# EAGLE design ControlPCB_v5 (EAGLE 9.7.0)
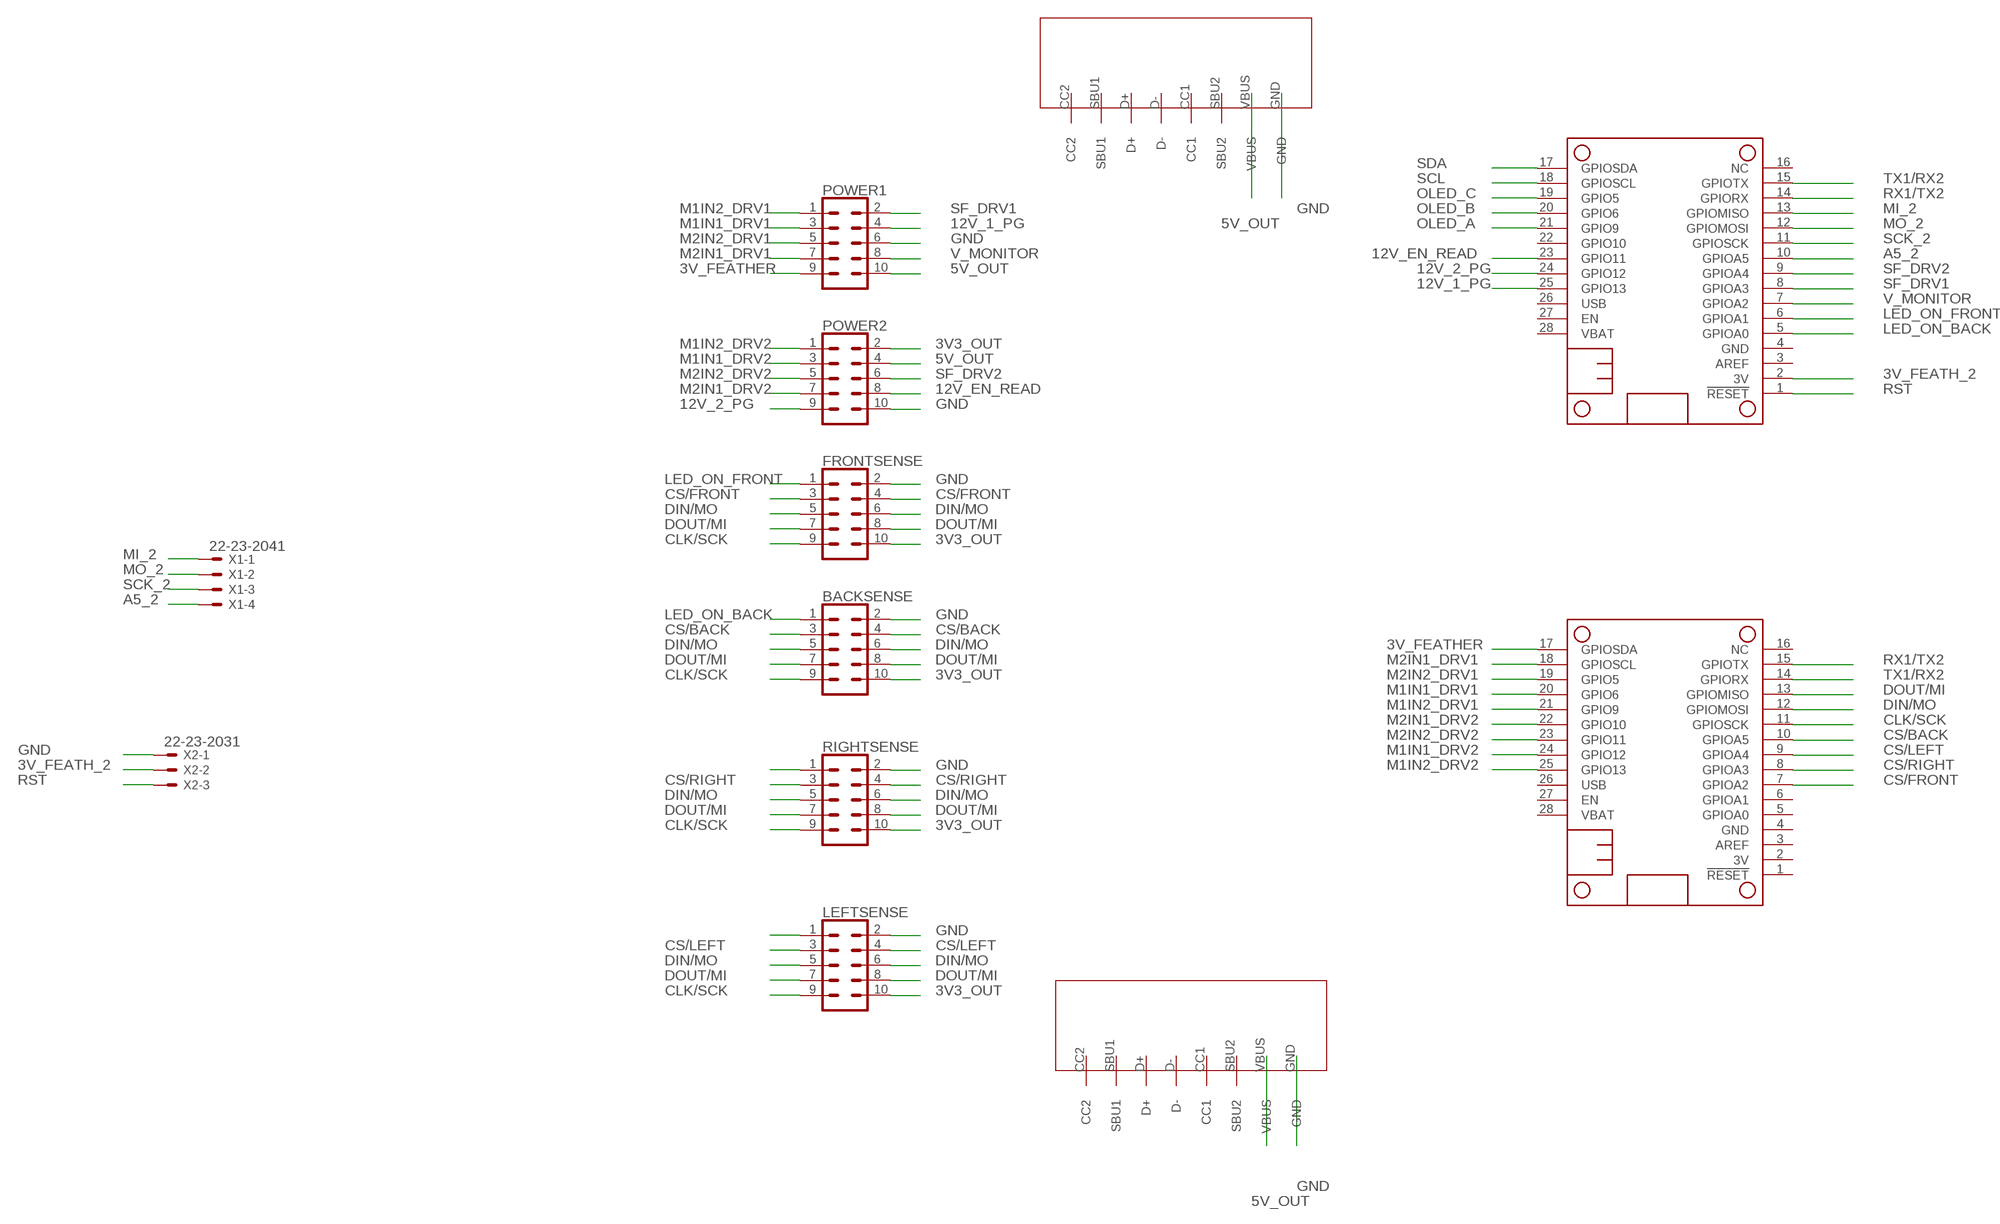
[diagram p0: schematic, sheet 1]

## Parts
BACKSENSE  CONN_05X2SHD  [2X5-SHROUDED]
FRONTSENSE  CONN_05X2SHD  [2X5-SHROUDED]
LEFTSENSE  CONN_05X2SHD  [2X5-SHROUDED]
MS3  CUSTOM_FEATHER  [FEATHERWING]
MS4  CUSTOM_FEATHER  [FEATHERWING]
POWER1  CONN_05X2SHD  [2X5-SHROUDED]
POWER2  CONN_05X2SHD  [2X5-SHROUDED]
RIGHTSENSE  CONN_05X2SHD  [2X5-SHROUDED]
U$1  CUSTOM_USBC_BRKOUT  [CUSTOM_USBC_BRKOUT]
U$2  CUSTOM_USBC_BRKOUT  [CUSTOM_USBC_BRKOUT]
X1  22-23-2041  [22-23-2041]
X2  22-23-2031  [22-23-2031]

## Nets
3V3_OUT: BACKSENSE.10 FRONTSENSE.10 LEFTSENSE.10 POWER2.2 RIGHTSENSE.10
3V_FEATH_2: MS3.2(3V) X2.2
3V_FEATHER: MS4.17(GPIOSDA) POWER1.9
5V_OUT: POWER1.10 POWER2.4 U$1.VBUS U$2.VBUS
12V_1_PG: MS3.25(GPIO13) POWER1.4
12V_2_PG: MS3.24(GPIO12) POWER2.9
12V_EN_READ: MS3.23(GPIO11) POWER2.8
A5_2: MS3.10(GPIOA5) X1.4
CLK/SCK: BACKSENSE.9 FRONTSENSE.9 LEFTSENSE.9 MS4.11(GPIOSCK) RIGHTSENSE.9
CS/BACK: BACKSENSE.3 BACKSENSE.4 MS4.10(GPIOA5)
CS/FRONT: FRONTSENSE.3 FRONTSENSE.4 MS4.7(GPIOA2)
CS/LEFT: LEFTSENSE.3 LEFTSENSE.4 MS4.9(GPIOA4)
CS/RIGHT: MS4.8(GPIOA3) RIGHTSENSE.3 RIGHTSENSE.4
DIN/MO: BACKSENSE.5 BACKSENSE.6 FRONTSENSE.5 FRONTSENSE.6 LEFTSENSE.5 LEFTSENSE.6 MS4.12(GPIOMOSI) RIGHTSENSE.5 RIGHTSENSE.6
DOUT/MI: BACKSENSE.7 BACKSENSE.8 FRONTSENSE.7 FRONTSENSE.8 LEFTSENSE.7 LEFTSENSE.8 MS4.13(GPIOMISO) RIGHTSENSE.7 RIGHTSENSE.8
GND: BACKSENSE.2 FRONTSENSE.2 LEFTSENSE.2 POWER1.6 POWER2.10 RIGHTSENSE.2 U$1.GND U$2.GND X2.1
LED_ON_BACK: BACKSENSE.1 MS3.5(GPIOA0)
LED_ON_FRONT: FRONTSENSE.1 MS3.6(GPIOA1)
M1IN1_DRV1: MS4.20(GPIO6) POWER1.3
M1IN1_DRV2: MS4.24(GPIO12) POWER2.3
M1IN2_DRV1: MS4.21(GPIO9) POWER1.1
M1IN2_DRV2: MS4.25(GPIO13) POWER2.1
M2IN1_DRV1: MS4.18(GPIOSCL) POWER1.7
M2IN1_DRV2: MS4.22(GPIO10) POWER2.7
M2IN2_DRV1: MS4.19(GPIO5) POWER1.5
M2IN2_DRV2: MS4.23(GPIO11) POWER2.5
MI_2: MS3.13(GPIOMISO) X1.1
MO_2: MS3.12(GPIOMOSI) X1.2
N$41: RIGHTSENSE.1
N$60: LEFTSENSE.1
OLED_A: MS3.21(GPIO9)
OLED_B: MS3.20(GPIO6)
OLED_C: MS3.19(GPIO5)
RST: MS3.1(!RESET) X2.3
RX1/TX2: MS3.14(GPIORX) MS4.15(GPIOTX)
SCK_2: MS3.11(GPIOSCK) X1.3
SCL: MS3.18(GPIOSCL)
SDA: MS3.17(GPIOSDA)
SF_DRV1: MS3.8(GPIOA3) POWER1.2
SF_DRV2: MS3.9(GPIOA4) POWER2.6
TX1/RX2: MS3.15(GPIOTX) MS4.14(GPIORX)
V_MONITOR: MS3.7(GPIOA2) POWER1.8
Unconnected: MS3.3(AREF) MS3.16(NC) MS3.22(GPIO10) MS3.26(USB) MS3.27(EN) MS3.28(VBAT) MS4.1(!RESET) MS4.2(3V) MS4.3(AREF) MS4.5(GPIOA0) MS4.6(GPIOA1) MS4.16(NC) MS4.26(USB) MS4.27(EN) MS4.28(VBAT) U$1.CC1 U$1.CC2 U$1.D+ U$1.D- U$1.SBU1 U$1.SBU2 U$2.CC1 U$2.CC2 U$2.D+ U$2.D- U$2.SBU1 U$2.SBU2

## Power pins joined to a net without a drawn wire
GND: MS3.4(GND) MS4.4(GND)

## Library data of the parts
BACKSENSE FRONTSENSE LEFTSENSE POWER1 POWER2 RIGHTSENSE = SparkFun-Connectors:CONN_05X2: Multi connection point. Often used as Generic Header-pin footprint for 0.1 inch spaced/style header connections For AVR SPI programming port, see special device with nice symbol: "AVR_SPI_PROG_5x2.dev" You can populate with any combo of single row headers, but if you'd like an exact match, check these: 2x5 AVR ICSP Male Header <https://www.sparkfun.com/products/778> (PRT-00778) 2x5 Pin Shrouded Header <https://www.sparkfun.com/products/8506> (PRT-08506) On any of the 0.1 inch spaced packages, you can populate with these: Break Away Headers - Straight <https://www.sparkfun.com/products/116> (PRT-00116) Break Away Male Headers - Right Angle <https://www.sparkfun.com/products/553> (PRT-00553) Female Headers <https://www.sparkfun.com/products/115> (PRT-00115) Break Away Headers - Machine Pin <https://www.sparkfun.com/products/117> (PRT-00117) Break Away Female Headers - Swiss Machine Pin <https://www.sparkfun.com/products/743> (PRT-00743) Special note: the shrouded connector mates well with our 5x2 ribbon cables: 2x5 Pin IDC Ribbon Cable <https://www.sparkfun.com/products/8535> (PRT-08535); PROD_ID: CONN-08671; SF_ID: PRT-08506
MS3 MS4 = Custom_Feather:CUSTOM_FEATHER
U$1 U$2 = Custom_UBC_BRKOUT:CUSTOM_USBC_BRKOUT
X1 = con-molex:22-23-2041: .100" (2.54mm) Center Header - 4 Pin; MF: MOLEX; MPN: 22-23-2041; OC_FARNELL: 1462920; OC_NEWARK: 38C0355
X2 = con-molex:22-23-2031: .100" (2.54mm) Center Header - 3 Pin; MF: MOLEX; MPN: 22-23-2031; OC_FARNELL: 1462950; OC_NEWARK: 30C0862

## Board
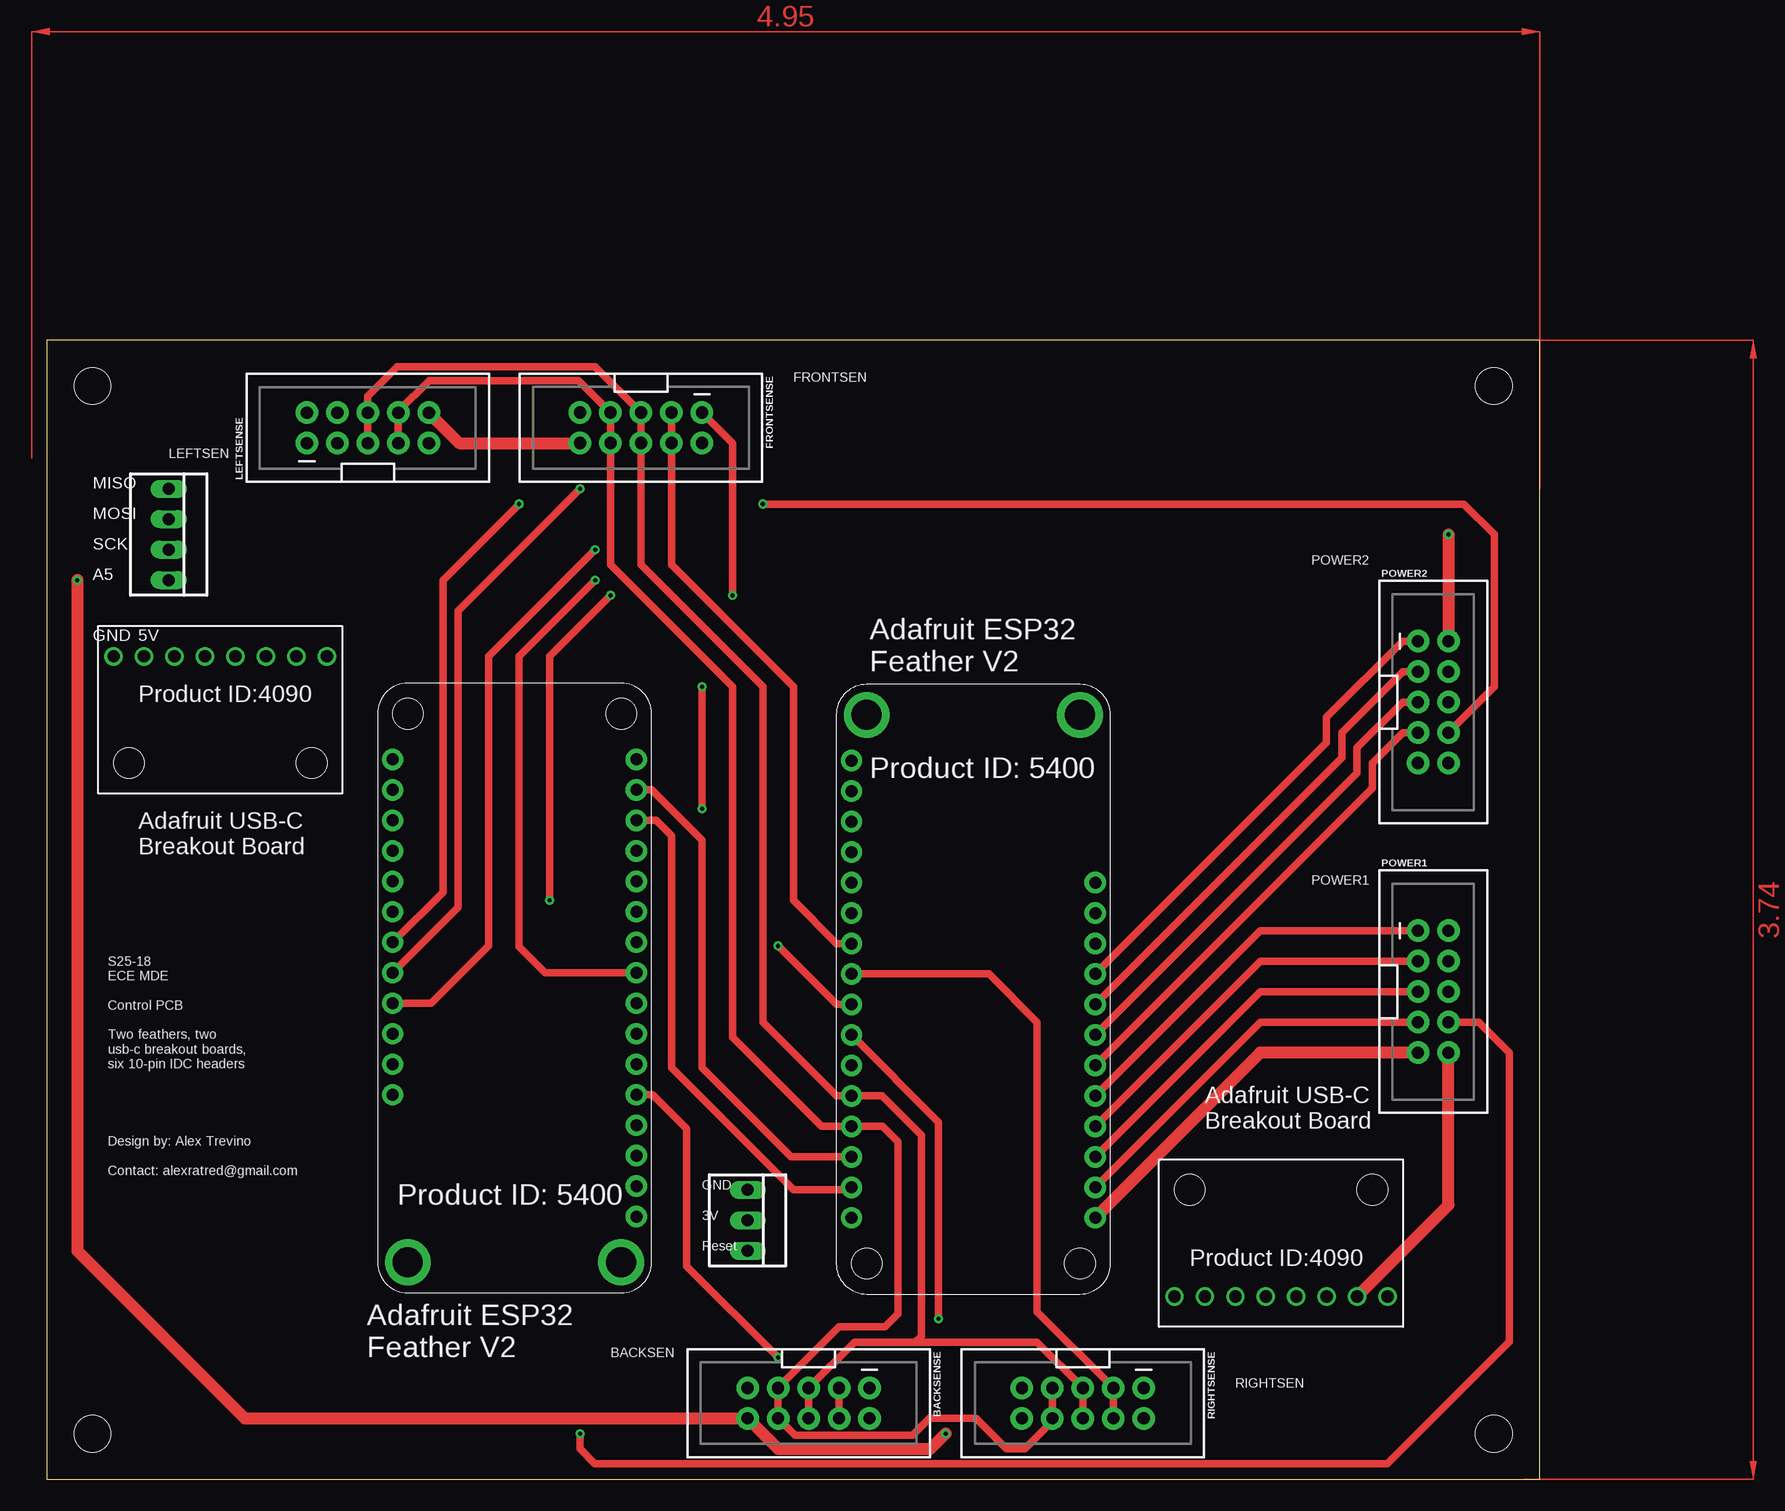
[diagram p1: board, top side]
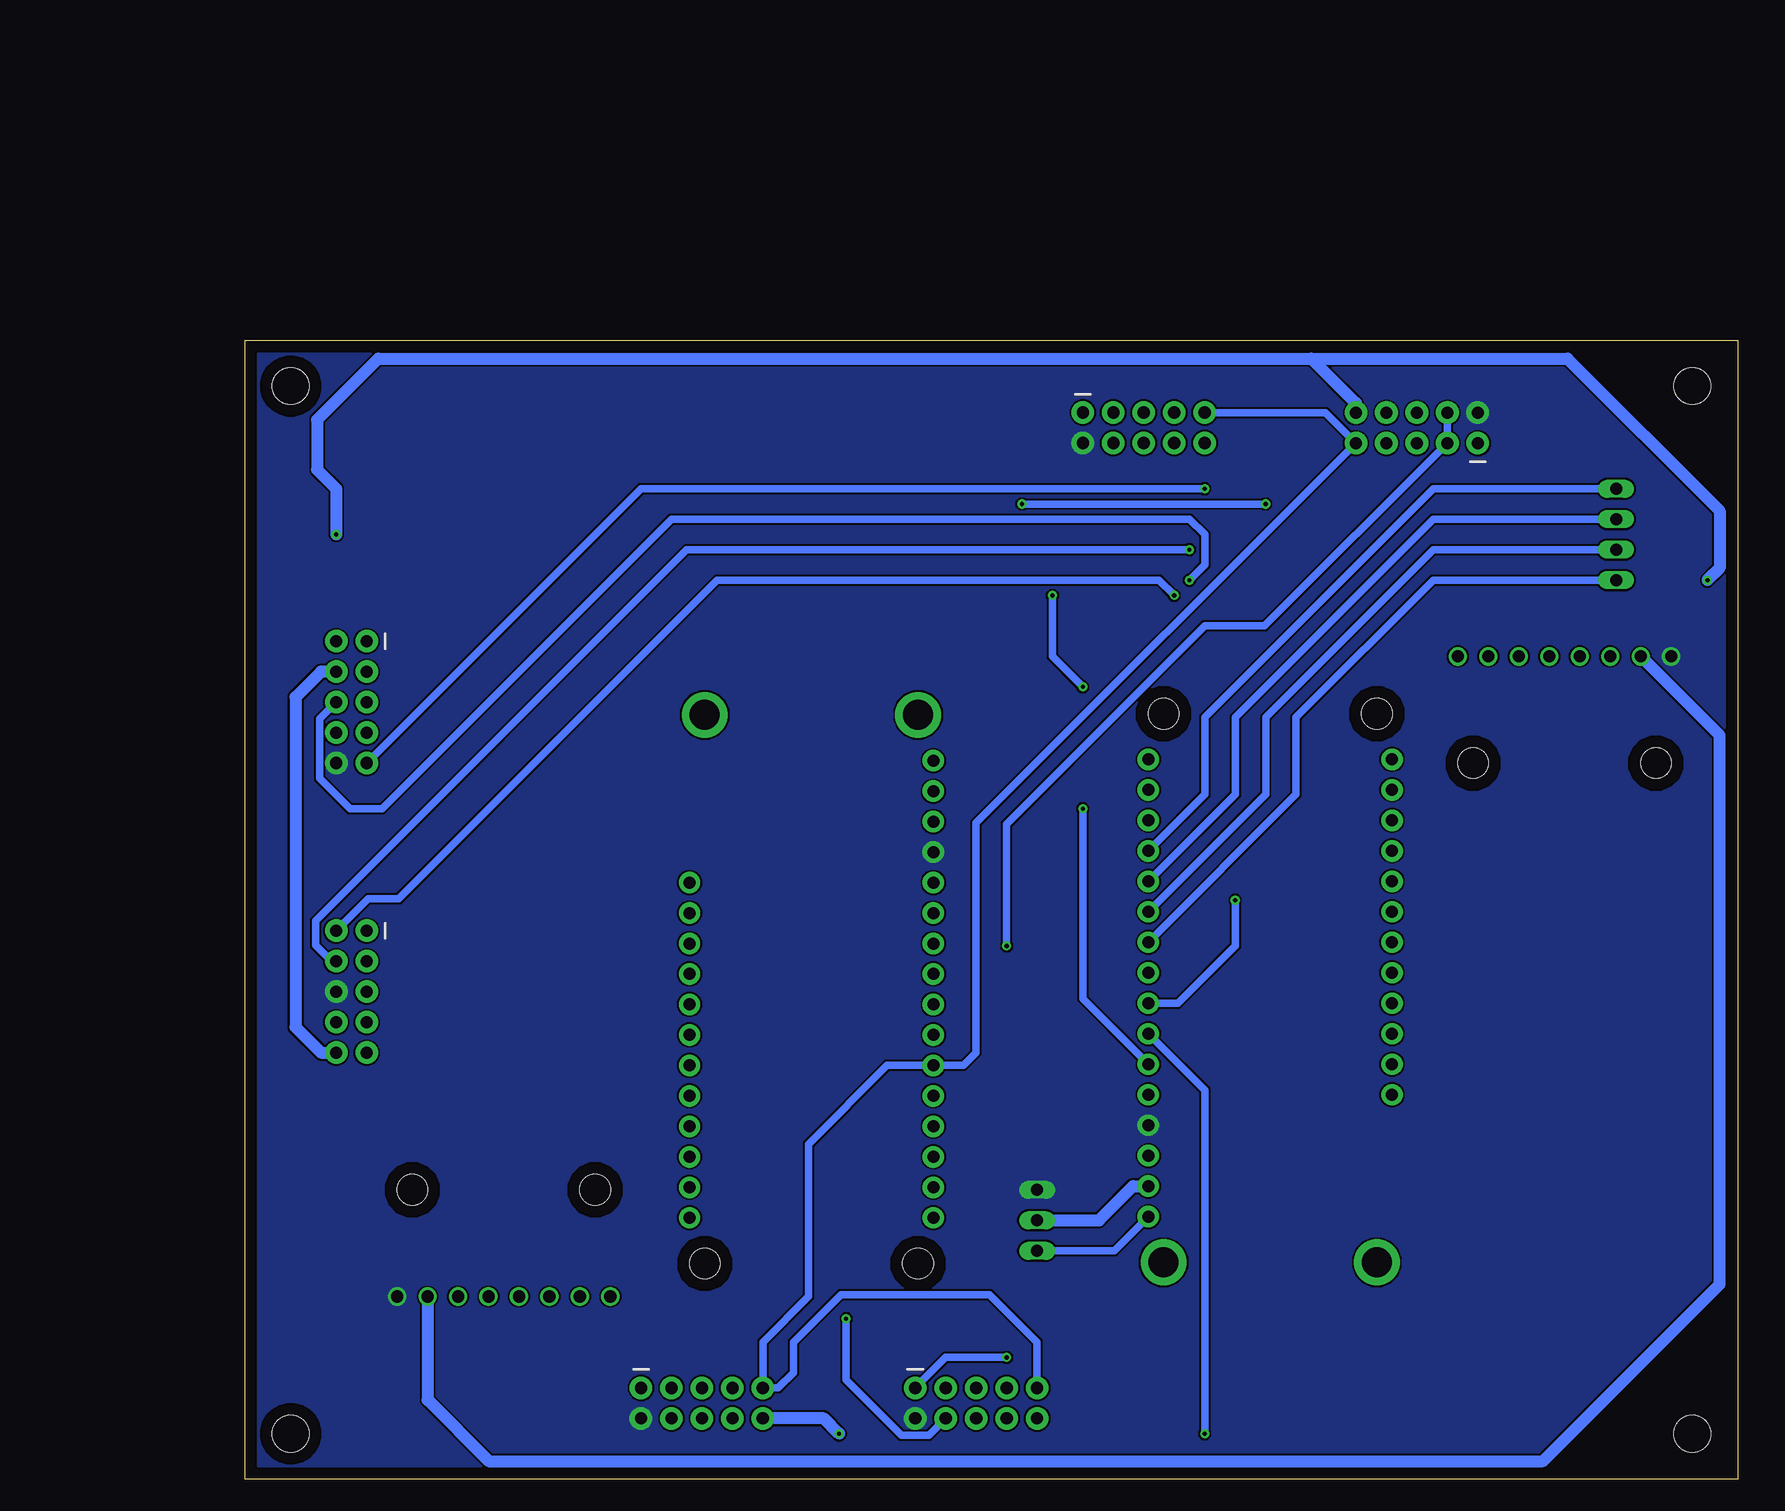
[diagram p2: board, bottom side, seen from below]

Size 124.44 x 94.92 mm. Coordinates in mm from the lower left corner, seen from the top.
Outline: 0,0 124.44,0 124.44,94.92 0,94.92 0,0
Copper layers (1*16): Top / Bottom
Stack-up Default Layer Stack: Top User Defined 0.035mm / Dielectric-1 User Defined 1.5mm / Bottom User Defined 0.035mm
Design rules: minimum copper width 6mil, minimum drill size 0.35mm, copper clearance wire_polygon to wire_polygon 6mil, copper clearance wire_polygon to pad_smd 6mil, copper clearance wire_polygon to via 6mil, copper clearance pad_smd to pad_smd 6mil, copper clearance pad_smd to via 6mil, copper clearance via to via 6mil, copper clearance smd to pad (same net) 6mil, copper clearance smd to via (same net) 6mil, copper clearance smd to smd (same net) 6mil, dimension clearance 40mil, via restrict clearance 0mil, restrict clearance 0mil, drill distance 6mil, keepout clearance 0mil
Holes 3.05 mm at 3.81,91.11 120.63,91.11 120.63,3.81 3.81,3.81

### Footprints (pad centres in the part's own frame; a part is rotated, then mirrored left to right if it is on the bottom)
2X5-SHROUDED = drill 1.016 pad 1.88: 1 -1.27,5.08; 2 1.27,5.08; 3 -1.27,2.54; 4 1.27,2.54; 5 -1.27,0; 6 1.27,0; 7 -1.27,-2.54; 8 1.27,-2.54; 9 -1.27,-5.08; 10 1.27,-5.08
FEATHERWING = drill 1 pad 1.778: 1 6.35,1.27; 2 8.89,1.27; 3 11.43,1.27; 4 13.97,1.27; 5 16.51,1.27; 6 19.05,1.27; 7 21.59,1.27; 8 24.13,1.27; 9 26.67,1.27; 10 29.21,1.27; 11 31.75,1.27; 12 34.29,1.27; 13 36.83,1.27; 14 39.37,1.27; 15 41.91,1.27; 16 44.45,1.27; 17 44.45,21.59; 18 41.91,21.59; 19 39.37,21.59; 20 36.83,21.59; 21 34.29,21.59; 22 31.75,21.59; 23 29.21,21.59; 24 26.67,21.59; 25 24.13,21.59; 26 21.59,21.59; 27 19.05,21.59; 28 16.51,21.59 | drill 2.5 pad 3.81: P$1 2.54,20.32; P$2 2.54,2.54 | hole 2.54: 48.26,20.32; 48.26,2.54
CUSTOM_USBC_BRKOUT = drill 1.016: CC1 11.43,2.54; CC2 1.27,2.54; D+ 6.35,2.54; D- 8.89,2.54; GND 19.05,2.54; SBU1 3.81,2.54; SBU2 13.97,2.54; VBUS 16.51,2.54 | hole 2.54: 2.54,11.43; 17.78,11.43
22-23-2041 = drill 1 long: 1 -3.81,0; 2 -1.27,0; 3 1.27,0; 4 3.81,0
22-23-2031 = drill 1 long: 1 -2.54,0; 2 0,0; 3 2.54,0

### Placement (x,y rotation side)
BACKSENSE  63.5,6.35 270 top
FRONTSENSE  49.53,87.63 270 top
LEFTSENSE  26.77,87.62 90 top
MS3  50.42,15.55 90 top
MS4  65.8,66.24 270 top
POWER1  115.57,40.64 0 top
POWER2  115.57,64.77 0 top
RIGHTSENSE  86.36,6.35 270 top
U$1  24.62,71.12 180 top
U$2  92.72,12.7 0 top
X1  10.16,78.74 270 top
X2  58.42,21.59 270 top

### Tracks (layer width: path | path; a pad name or v marks a point on that pad's centre or on a via)
3V3_OUT  (via drill 0.35)
  Top 1.016: v116.84,78.74 POWER2.2 | LEFTSENSE.10 34.38,86.36 FRONTSENSE.10 | v2.54,74.93 2.54,19.05 16.51,5.08 BACKSENSE.10 60.96,2.54 73.66,2.54 v74.93,3.81
  Bottom 1.016: 35.56,93.4 113.34,93.4 118.44,88.29 118.44,84.15 116.84,82.55 v116.84,78.74 | 35.56,93.4 14.22,93.4 1.52,80.7 1.52,75.95 v2.54,74.93 | 35.56,93.4 31.85,89.68 LEFTSENSE.10 | v74.93,3.81 76.2,5.08 RIGHTSENSE.10
3V_FEATH_2
  Bottom 1.016: MS3.2 50.42,24.43 53.26,21.59 X2.2
3V_FEATHER
  Top 1.016: POWER1.9 101.16,35.56 MS4.17
5V_OUT
  Top 1.016: U$2.VBUS 116.84,22.85 POWER1.10
  Bottom 1.016: U$2.VBUS 109.23,6.61 104.14,1.52 16.26,1.52 1.52,16.26 1.52,62 U$1.VBUS | POWER2.4 118.11,67.31 120.23,65.19 120.23,37.68 118.11,35.56 POWER1.10
12V_1_PG  (via drill 0.35)
  Top 0.61: v45.72,77.47 36.83,68.58 36.83,44.45 32.05,39.67 MS3.25
  Bottom 0.61: POWER1.4 117.24,43.18 118.57,44.51 118.57,46.53 87.63,77.47 v45.72,77.47
12V_2_PG  (via drill 0.35)
  Top 0.61: v44.45,82.55 34.29,72.39 34.29,47.68 MS3.24
  Bottom 0.61: POWER2.9 91.44,82.55 v44.45,82.55
12V_EN_READ  (via drill 0.35)
  Top 0.61: POWER2.8 120.65,66.04 120.65,78.74 118.11,81.28 v59.69,81.28 | v39.37,81.28 33.02,74.93 33.02,48.95 MS3.23
  Bottom 0.61: v59.69,81.28 v39.37,81.28
A5_2
  Bottom 0.61: MS3.10 36.83,57.07 36.83,63.5 25.4,74.93 X1.4
CLK/SCK
  Bottom 0.61: RIGHTSENSE.9 81.28,11.43 77.47,15.24 77.47,27.94 70.91,34.49 MS4.11 64.56,34.49 63.5,35.56 63.5,54.7 LEFTSENSE.9 34.39,88.9 FRONTSENSE.9 | BACKSENSE.9 58.42,11.43 62.38,15.39 74.78,15.39 78.74,11.43 78.74,8.89 80.01,7.62 RIGHTSENSE.9 | RIGHTSENSE.9 81.28,8.89
CS/BACK  (via drill 0.35)
  Top 0.61: BACKSENSE.3 BACKSENSE.4 | MS4.10 74.34,29.77 v74.34,13.38
  Bottom 0.61: BACKSENSE.4 67.44,3.68 69.72,3.68 74.34,8.3 v74.34,13.38
CS/FRONT
  Top 0.61: FRONTSENSE.3 FRONTSENSE.4 52.07,76.2 62.23,66.04 62.23,48.26 65.83,44.66 MS4.7
CS/LEFT  (via drill 0.35)
  Top 0.61: v60.96,44.45 65.83,39.57 MS4.9
  Bottom 0.61: LEFTSENSE.4 LEFTSENSE.3 39.46,71.12 44.45,71.12 60.96,54.61 v60.96,44.45
CS/RIGHT
  Top 0.61: RIGHTSENSE.4 RIGHTSENSE.3 82.55,13.97 82.55,38.1 78.53,42.12 MS4.8
DIN/MO
  Top 0.61: LEFTSENSE.5 LEFTSENSE.6 26.77,90.27 29.21,92.71 45.72,92.71 FRONTSENSE.5 FRONTSENSE.6 49.53,76.2 59.69,66.04 59.69,38.1 65.83,31.95 MS4.12 69.61,31.95 72.9,28.67 72.9,11.94 72.39,11.43 | RIGHTSENSE.6 RIGHTSENSE.5 82.55,11.43 72.39,11.43 | BACKSENSE.6 BACKSENSE.5 67.31,11.43 72.39,11.43
DOUT/MI
  Top 0.61: LEFTSENSE.7 LEFTSENSE.8 29.31,89 31.88,91.57 44.32,91.57 FRONTSENSE.7 FRONTSENSE.8 46.99,76.2 57.15,66.04 57.15,36.83 64.56,29.41 MS4.13 69.64,29.41 70.93,28.13 70.93,13.78 69.85,12.7 66.04,12.7 BACKSENSE.7 BACKSENSE.8 62.36,3.68 72.17,3.68 73.56,5.08 77.47,5.08 80.01,2.54 81.53,2.54 83.82,4.83 RIGHTSENSE.8 RIGHTSENSE.7
GND
  pour Bottom (no thermals): -3.81,96.52 128.27,96.52 128.27,-2.54 -3.81,-2.54
LED_ON_BACK  (via drill 0.35)
  Top 0.61: v60.96,10.16 53.34,17.78 53.34,29.21 50.5,32.05 MS3.5
  Bottom 0.61: BACKSENSE.1 66.04,10.16 v60.96,10.16
LED_ON_FRONT  (via drill 0.35)
  Top 0.61: FRONTSENSE.1 57.15,86.36 v57.15,73.66 | v54.61,66.04 v54.61,55.88
  Bottom 0.61: v57.15,73.66 57.15,68.58 v54.61,66.04 | v54.61,55.88 54.61,40.06 MS3.6
M1IN1_DRV1
  Top 0.61: POWER1.3 101.16,43.18 MS4.20
M1IN1_DRV2
  Top 0.61: MS4.24 107.95,60.13 107.95,62.23 113.03,67.31 POWER2.3
M1IN2_DRV1
  Top 0.61: POWER1.1 101.16,45.72 MS4.21
M1IN2_DRV2
  Top 0.61: MS4.25 106.68,61.4 106.68,63.5 113.03,69.85 POWER2.1
M2IN1_DRV1
  Top 0.61: POWER1.7 101.16,38.1 MS4.18
M2IN1_DRV2
  Top 0.61: MS4.22 107.73,54.83 107.82,54.92 110.49,57.59 110.49,59.69 113.03,62.23 POWER2.7
M2IN2_DRV1
  Top 0.61: POWER1.5 101.16,40.64 MS4.19
M2IN2_DRV2
  Top 0.61: MS4.23 106.46,56.1 106.55,56.2 109.22,58.86 109.22,60.96 113.03,64.77 POWER2.5
MI_2
  Bottom 0.61: MS3.13 44.45,57.07 44.45,63.5 25.4,82.55 X1.1
MO_2
  Bottom 0.61: MS3.12 41.91,57.07 41.91,63.5 25.4,80.01 X1.2
RST
  Bottom 0.61: MS3.1 51.99,19.05 X2.3
RX1/TX2
  Top 0.61: MS4.15 66.87,24.13 62.23,24.13 52.07,34.29 52.07,53.64 50.8,54.91 MS3.14
SCK_2
  Bottom 0.61: MS3.11 39.37,57.07 39.37,63.5 25.4,77.47 X1.3
SF_DRV1  (via drill 0.35)
  Top 0.61: v46.99,73.66 41.91,68.58 v41.91,48.26
  Bottom 0.61: POWER1.2 114.17,48.39 111.63,48.39 85.09,74.93 48.26,74.93 v46.99,73.66 | v41.91,48.26 41.91,44.45 46.69,39.67 MS3.8
SF_DRV2  (via drill 0.35)
  Top 0.61: v45.72,74.93 39.37,68.58 39.37,44.37 41.53,42.21 MS3.9
  Bottom 0.61: POWER2.6 118.24,63.37 118.24,58.42 115.7,55.88 113.03,55.88 88.9,80.01 45.72,80.01 44.45,78.74 44.45,76.2 v45.72,74.93
TX1/RX2
  Top 0.61: MS3.15 50.42,57.45 54.61,53.26 54.61,34.29 62.03,26.88 MS4.14
V_MONITOR  (via drill 0.35)
  Top 0.61: POWER1.8 119.38,38.1 121.92,35.56 121.92,11.48 111.76,1.32 45.67,1.32 44.45,2.54 v44.45,3.81
  Bottom 0.61: v44.45,3.81 44.45,32.44 MS3.7
(copper drawn outside any net)
  shapes: Top area x2

### Text on the board
SilkscreenTop: FRONTSEN | LEFTSEN | MISO | MOSI | SCK | POWER2 | A5 | GND | 5V | Adafruit ESP32 / Feather V2 | Product ID:4090 | Product ID: 5400 | Adafruit USB-C / Breakout Board | POWER1 | S25-18 / ECE MDE / / Control PCB / / Two feathers, two / usb-c breakout boards, / six 10-pin IDC headers | Adafruit USB-C / Breakout Board | Design by: Alex Trevino / / Contact: alexratred@gmail.com | GND | Product ID: 5400 | 3V | Reset | Product ID:4090 | Adafruit ESP32 / Feather V2 | BACKSEN | RIGHTSEN